# EasyEDA Pro project Mini inverter 12v to 220v.eprj

# Schematic Schematic1
Board Name: Board1; Create Date: 2026-03-27; Page Name: P1; Project Name: Mini inverter 12v to 220v; Schematic Name: Schematic1; Update Date: 2026-03-27; Company: EasyEDA.com; Page Size: A4; Version: V1.0
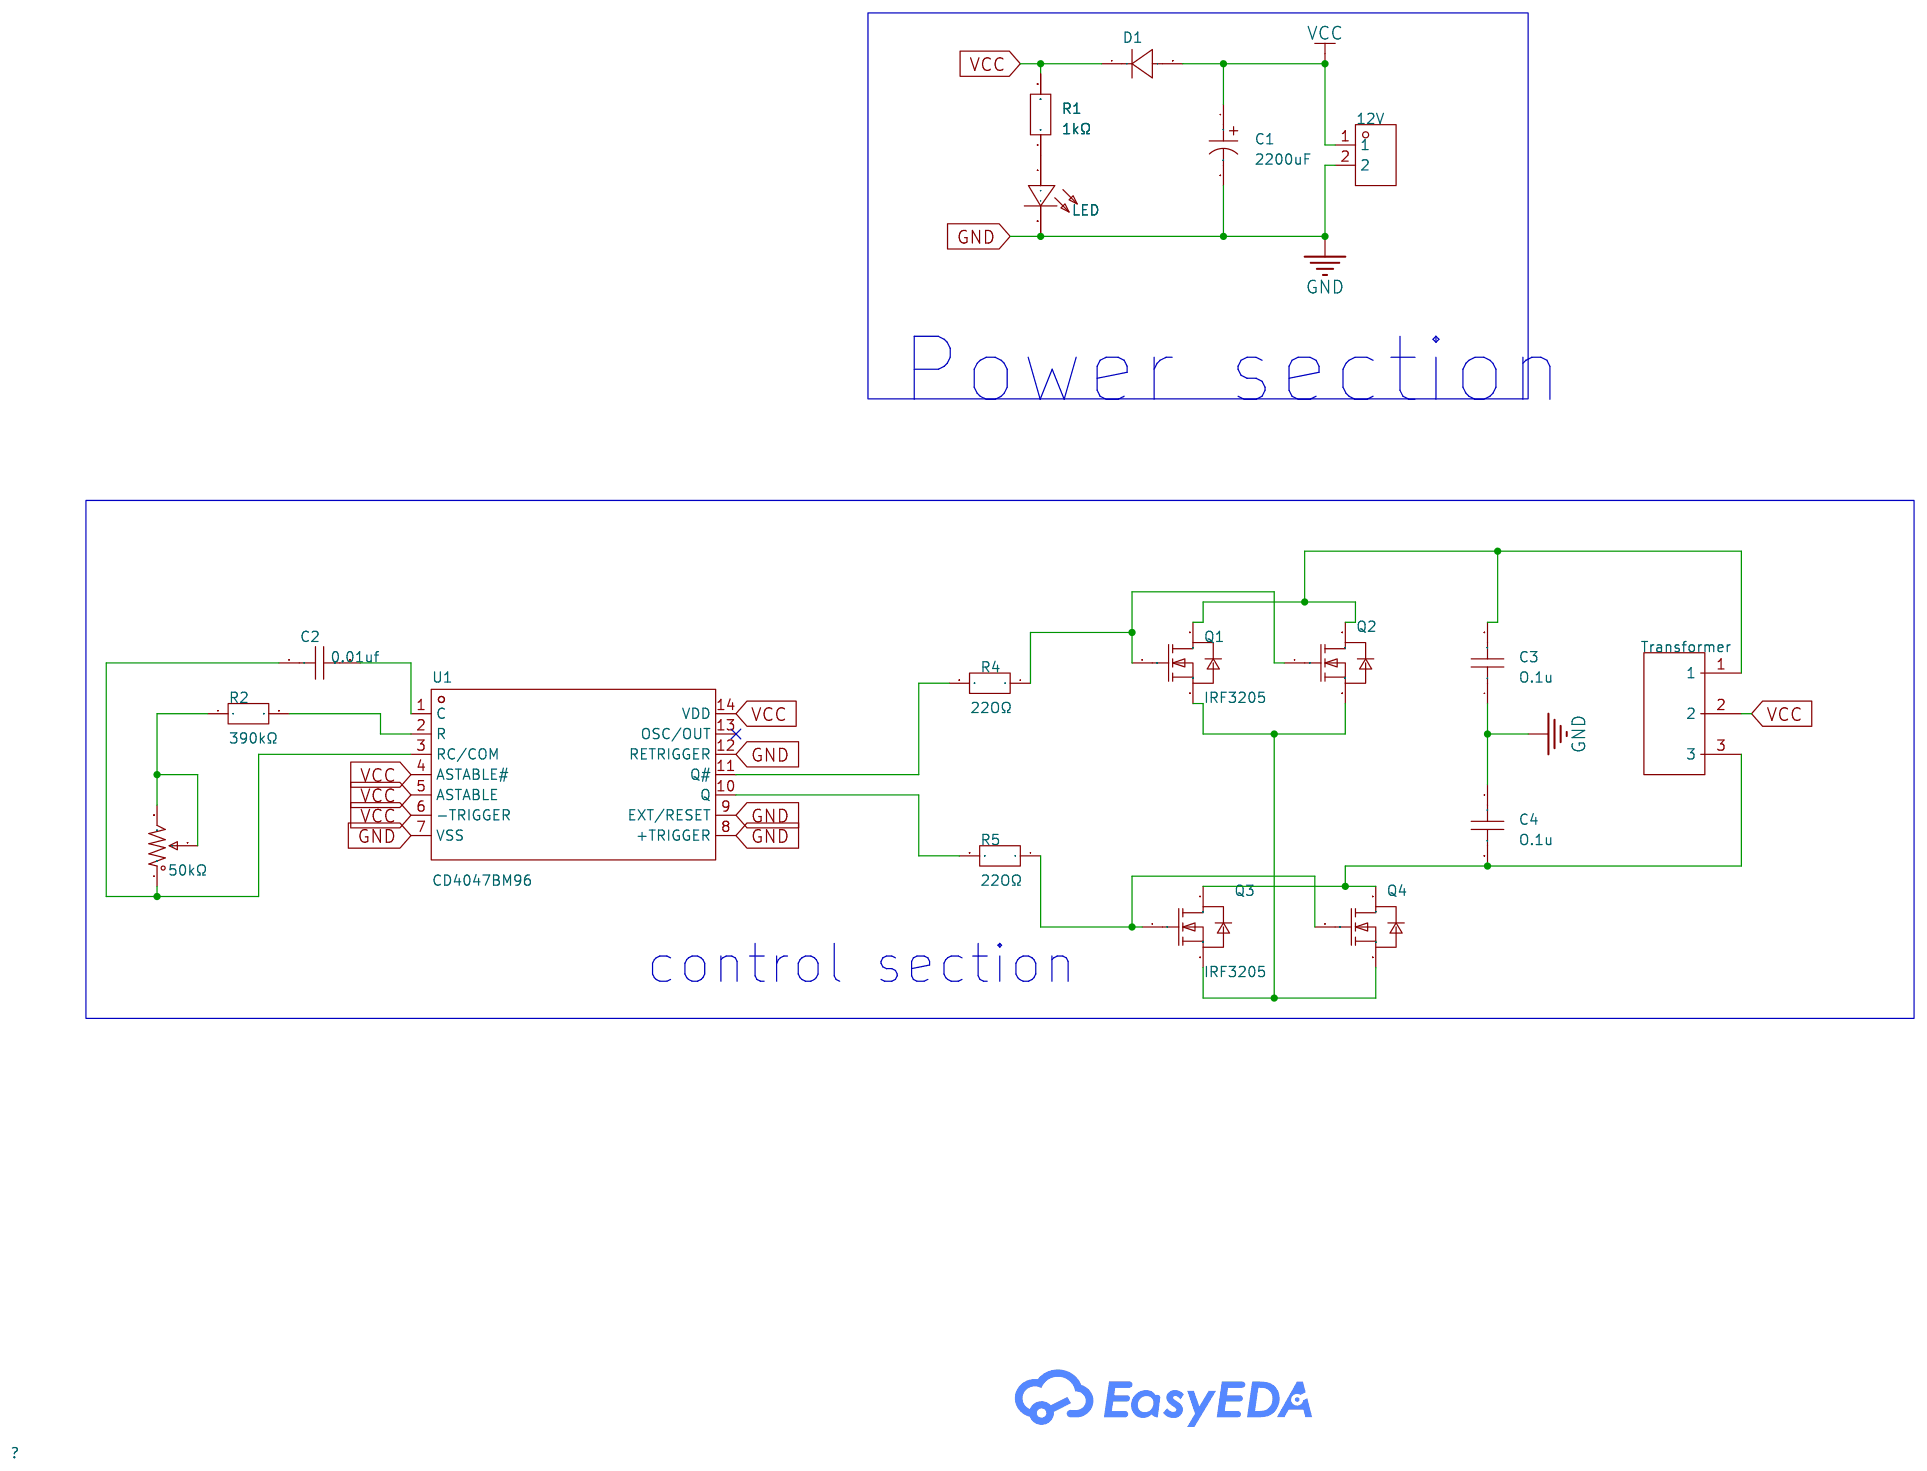
[diagram p0: schematic sheet]

## Parts
12V  WJ126V-5.0-2P-16-00A  [CONN-TH_WJ126V-5.0-2P]
C1  2200uF  [CAP-TH_BD13.0-P5.00-D0.6-FD]
C2  0.01uf  [C0603]
C3  O.1u  [C0603]
C4  O.1u  [C0603]
D1  -  [DO-41_BD2.4-L4.7-P8.70-D0.9-RD]
Q1  IRF3205  [TO-220-3_L10.0-W4.6-P2.54-L]
Q2  IRF3205  [TO-220-3_L10.0-W4.6-P2.54-L]
Q3  IRF3205  [TO-220-3_L10.0-W4.6-P2.54-L]
Q4  IRF3205  [TO-220-3_L10.0-W4.6-P2.54-L]
R1  1kΩ  [RES-TH_BD6.0-L17.5-P21.50-D0.8]
R2  390kΩ  [RES-TH_BD6.0-L17.5-P21.50-D0.8]
R3  50kΩ  [RES-ADJ-SMD_3P-L5.0-W4.5-P2.30-LS6.5_23BXX]
R4  22OΩ  [RES-TH_BD6.0-L17.5-P21.50-D0.8]
R5  22OΩ  [RES-TH_BD6.0-L17.5-P21.50-D0.8]
Transformer  WJ126V-5.0-03P-14-00A  [CONN-TH_3P-P5.00_WJ126V-5.0-3P]
U1  CD4047BM96  [SOP-14_L8.6-W3.9-P1.27-LS6.0-BL]
U2  LED  [LED-TH_BD4.0-P2.54-FD_RED]

## Library data of the parts
12V = WJ126V-5.0-2P-16-00A: LCSC Part Name: 红色 5mm 直插 排数:1 每排P数:2; Supplier Part: C3031437; Manufacturer: KANGNEX(康奈克斯电气); Supplier Footprint: 插件,P=5mm; JLCPCB Part Class: Extended Part; Datasheet: https://item.szlcsc.com/datasheet/WJ126V-5.0-2P-16-00A/3568895.html; Supplier: LCSC; Pitch: 5mm; Color: Red; Mounting Type: Through Hole; Number of Pins: 2P; Number of Rows: 1; Number of PINs Per Row: 2; Screw Specification: M2.5; Current Rating: 8A; Voltage Rating (Max): 300V; Wire Gauge - AWG: 14~26; Wire Gauge - mm2: 2.5; Operating Temperature: -40℃~+105℃
C1 = ERA25V2200M13X21: LCSC Part Name: 2200uF ±20% 25V; Supplier Part: C49256800; Manufacturer: JIERR(捷而瑞); Supplier Footprint: 插件,D13xL21mm; JLCPCB Part Class: Extended Part; Datasheet: https://item.szlcsc.com/datasheet/ERA25V2200M13X21/51692200.html; Supplier: LCSC; Tolerance: ±20%; Voltage Rating: 25V; Pin Spacing: 5mm; Diameter: 13mm; Height - Seated (Max): 21mm; Lifetime: 2000hrs@105℃; Operating Temperature: -40℃~+105℃
C2-C4 = FCC0603B103K500CT: LCSC Part Name: 10nF ±10% 50V; Supplier Part: C5137477; Manufacturer: FOJAN(富捷); Supplier Footprint: 0603; JLCPCB Part Class: Extended Part; Datasheet: https://item.szlcsc.com/datasheet/FCC0603B103K500CT/5746979.html; Supplier: LCSC; Tolerance: ±10%; Voltage Rating: 50V; Temperature Coefficient: X7R
D1 = 1N4007: Supplier Footprint: DO-41
Q1-Q4 = IRF3205: LCSC Part Name: 1个N沟道 耐压:55V 电流:110A; Supplier Part: C19189952; Manufacturer: minos(迈诺斯); Supplier Footprint: TO-220; JLCPCB Part Class: Extended Part; Datasheet: https://item.szlcsc.com/datasheet/IRF3205/20422303.html; Supplier: LCSC; Number: One N-channel; Drain to Source Voltage: 55V; Current - Continuous Drain(Id): 110A; RDS(on): 9mΩ@10V; Pd - Power Dissipation: 210W; Gate Threshold Voltage (Vgs(th)): 4V@250uA; Gate Charge(Qg): 146nC@10V; Input Capacitance(Ciss): 3.247nF@25V; Reverse Transfer Capacitance (Crss@Vds): 211pF@25V; Operating Temperature: -55℃~+175℃; Type: N-Channel
R1 R2 R4 R5 = RSMF5JB1K00: LCSC Part Name: 金属氧化膜电阻 1kΩ ±5% 5W; Supplier Part: C2646141; Manufacturer: SEI(Stackpole Electronics Inc.); Supplier Footprint: 插件,D6xL17.5mm; JLCPCB Part Class: Extended Part; Datasheet: https://atta.szlcsc.com/upload/public/pdf/source/20210417/E7D670218B9E9D0CE2FA9103C376073D.pdf; Supplier: LCSC; Type: Metal Oxide Resistors; Tolerance: ±5%; Power(Watts): 5W; Temperature Coefficient: ±200ppm/℃; Operating Temperature: -55℃~+235℃
R3 = 23BR50KLFTR: LCSC Part Name: 50kΩ ±20%; Supplier Part: C5883569; Manufacturer: TT Electronics; JLCPCB Part Class: Extended Part; Datasheet: https://item.szlcsc.com/datasheet/23BR50KLFTR/6817880.html; Supplier: LCSC; Tolerance: ±20%; Power(Watts): 250mW; Temperature Coefficient: ±100ppm/℃
Transformer = WJ126V-5.0-03P-14-00A: LCSC Part Name: 1x3P 5mm 直插 排数:1 每排P数:3; Supplier Part: C8401; Manufacturer: KANGNEX(康奈克斯电气); Supplier Footprint: 插件,P=5mm; JLCPCB Part Class: Extended Part; Datasheet: https://item.szlcsc.com/datasheet/WJ126V-5.0-03P-14-00A/8895.html; Supplier: LCSC; Number of Positions or Pins: 1x3P; Pitch: 5mm; Color: Green; Mounting Type: Through Hole; Number of Pins: 3P; Number of Rows: 1; Number of PINs Per Row: 3; Current Rating: 18A; Voltage Rating (Max): 250V; Wire Gauge - AWG: 14~26; Wire Gauge - mm2: 2.5; Operating Temperature: -40℃~+105℃
U1 = CD4047BM96: Supplier Part: C46538; Manufacturer: TI(德州仪器); Supplier Footprint: SOP-14; JLCPCB Part Class: Extended Part; Datasheet: https://www.ti.com/cn/lit/gpn/cd4047b; Supplier: LCSC; Logic Type: Monostable；Astable; Voltage - Supply: 3V~18V; Number Of Channels: 1; Propagation Delay Time: 80ns; Current - Output Low(IOL): 6.8mA; Current - Output High(IOH): 6.8mA; Logic Family: 4000B; Operating Temperature: -55℃~+125℃
U2 = LED: Supplier Part: C9900015665; Supplier Footprint: SIP-2P; JLCPCB Part Class: Extended Part; Supplier: LCSC

## Nets
GND: 12V.2 C1.2 C3.1 C4.1 U1.7(VSS) U1.8(+TRIGGER) U1.9(EXT/RESET) U1.12(RETRIGGER) U2.2(-)
VCC: 12V.1 C1.1 D1.1(K) D1.2(A) R1.2 Transformer.2 U1.4(ASTABLE#) U1.5(ASTABLE) U1.6(-TRIGGER) U1.14(VDD)
$1N994: R1.1 U2.1(+)
$1N1364: C2.2 U1.1(C)
$1N1389: R2.2 U1.2(R)
$1N1395: R2.1 R3.2 R3.3
$1N1413: C2.1 R3.1 U1.3(RC/COM)
$1N1527: R4.2 U1.11(Q#)
$1N1541: R5.2 U1.10(Q)
$1N1850: Q1.1(G) Q2.1(G) R4.1
$1N2039: Q3.1(G) Q4.1(G) R5.1
$1N2051: Q1.3(S) Q2.3(S) Q3.3(S) Q4.3(S)
$1N2312: C3.2 Q1.2(D) Q2.2(D) Transformer.1
$1N2320: C4.2 Q3.2(D) Q4.2(D) Transformer.3

Not connected (* = marked no-connect by the designer): U1 13(OSC/OUT)*

## Notes on the sheet
- Power section
- control section

# Board PCB1
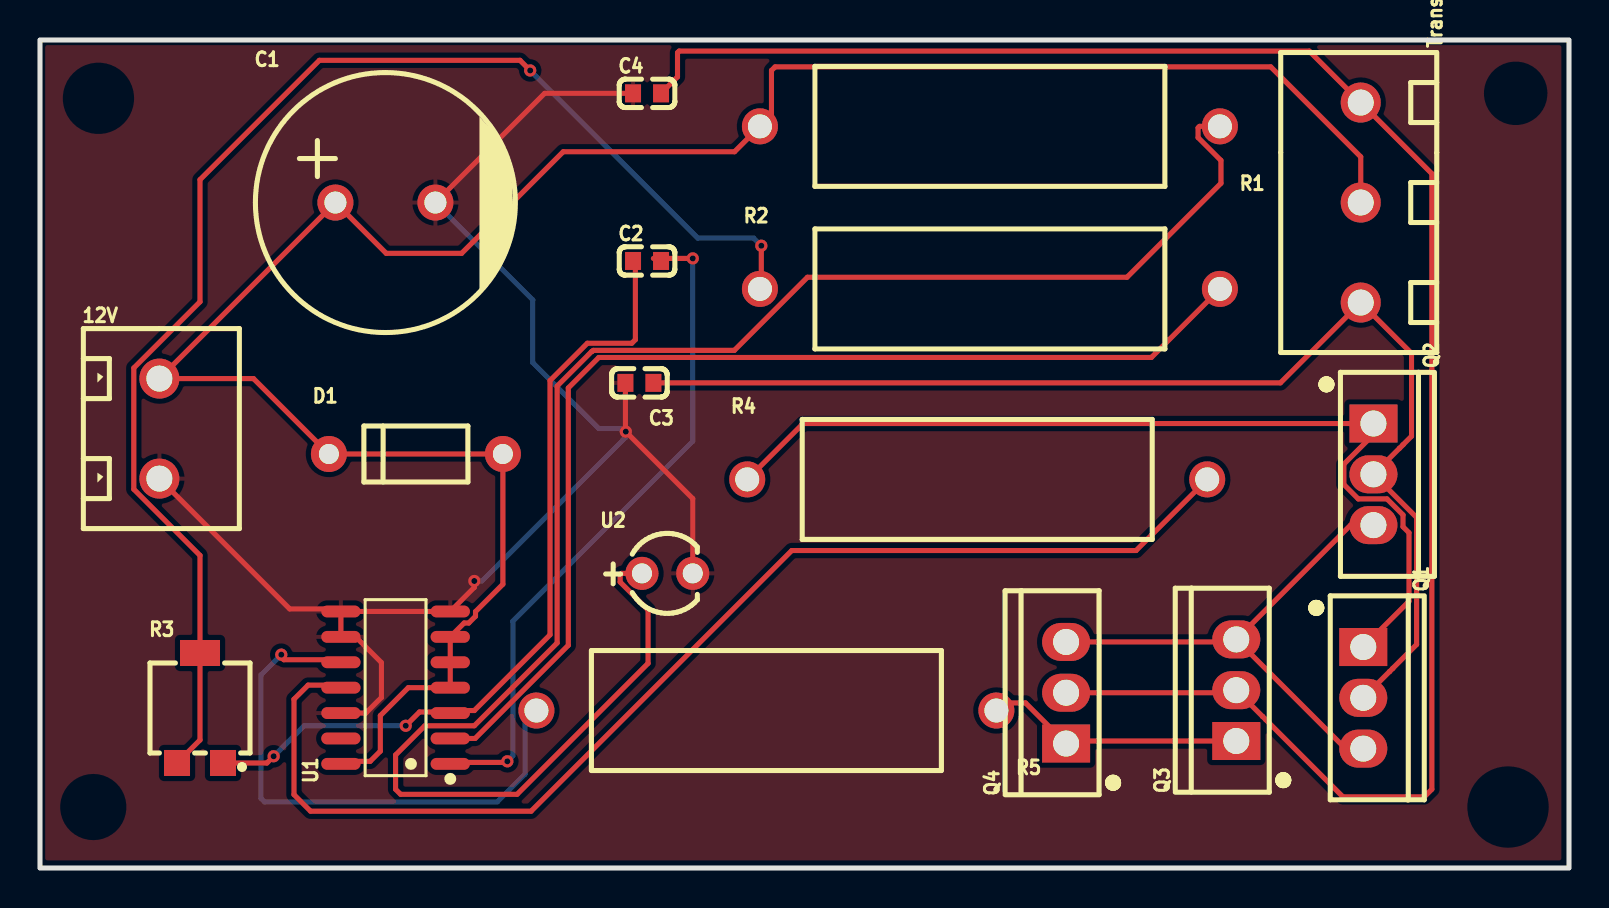
[diagram p1: board, top side]
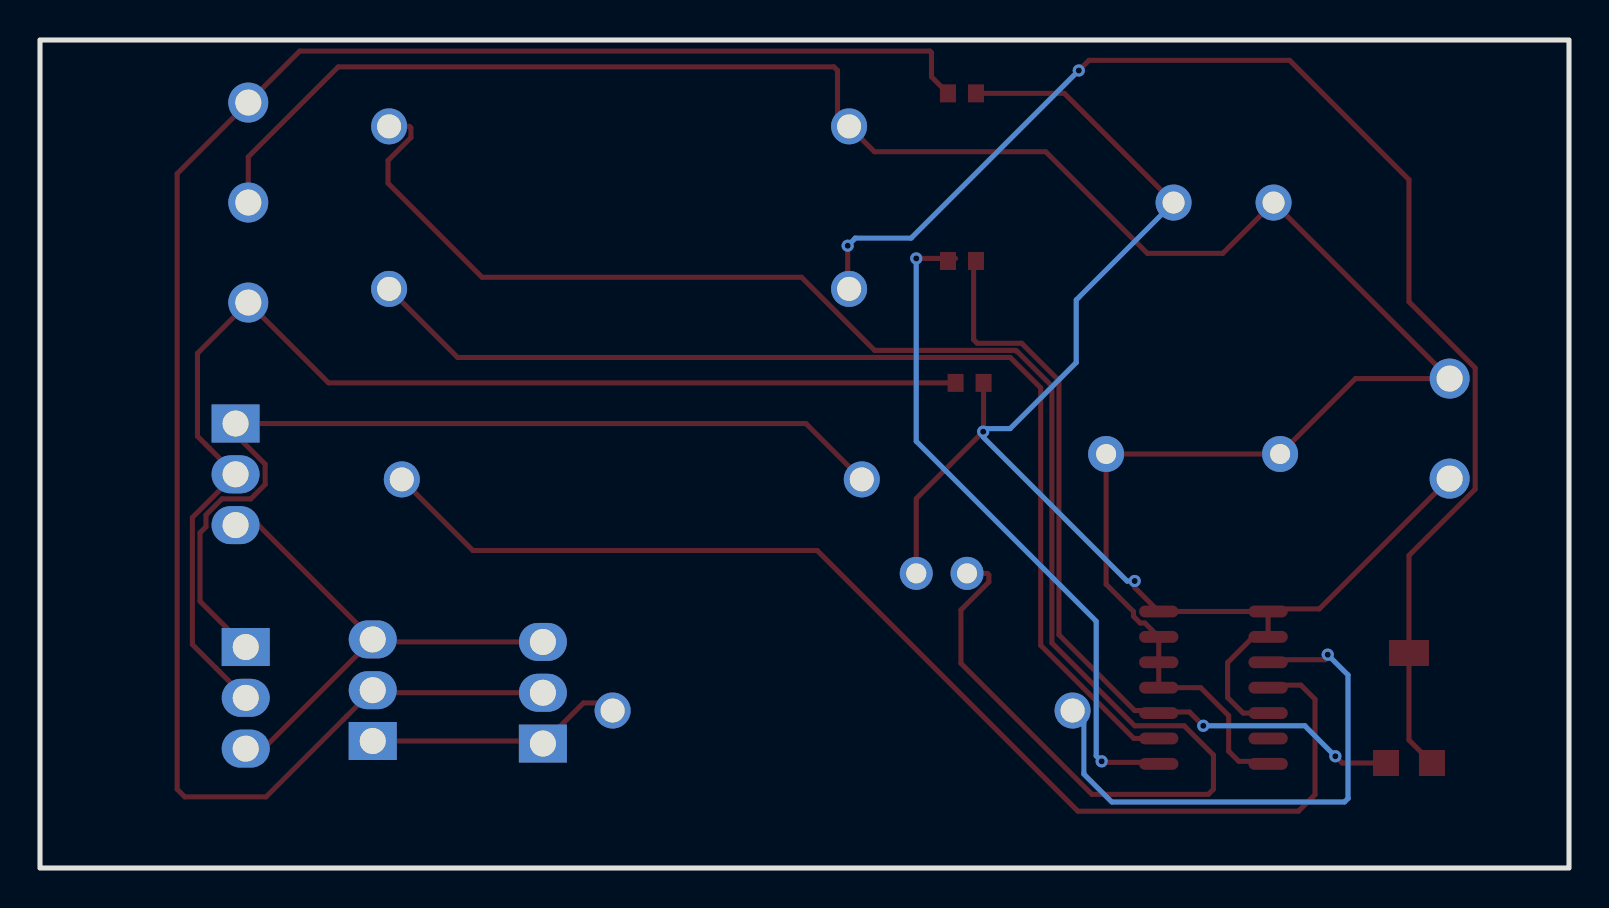
[diagram p2: board, bottom side, seen from below]

Outline 76.45 x 41.4 mm; copper layers: Top Layer, Bottom Layer. Coordinates in mm from the lower left corner of the outline.
Outline path: rectangle 0,41.4 76.45,0
Stack: Top Layer 0.035mm / Dielectric1 1.51mm FR4 er 4.5 / Bottom Layer 0.035mm

## Design rules (mm)
template: JLCPCB Capability(Two Layers Board)
spacing copperThickness1oz (default): track to track 0.102, other pairs 0.152 to 0.3
spacing copperThickness2oz: track to track 0.203, other pairs 0.152 to 0.3
track width copperThickness1oz (default): min 0.127, default 0.254, max 2.54
track width copperThickness2oz: min 0.203, default 0.254, max 2.54
differential pair differentialPair (default): width min 0.127, default 0.254, max 2.54; gap min 0.152, default 0.152
via viaSize (default): diameter min 0.5, default 0.61, max 10; hole min 0.3, default 0.305, max 6.3

## Placement (name value [footprint] x y rotation side)
12V  WJ126V-5.0-2P-16-00A  [CONN-TH_WJ126V-5.0-2P]  5.97 21.97 0 top
C1  2200uF  [CAP-TH_BD13.0-P5.00-D0.6-FD]  17.27 33.27 0 top
C2  0.01uf  [C0603]  30.35 30.35 0 top
C3  O.1u  [C0603]  29.97 24.26 0 top
C4  O.1u  [C0603]  30.35 38.73 0 top
D1  -  [DO-41_BD2.4-L4.7-P8.70-D0.9-RD]  18.8 20.7 0 top
Q1  IRF3205  [TO-220-3_L10.0-W4.6-P2.54-L]  66.17 8.51 270 top
Q2  IRF3205  [TO-220-3_L10.0-W4.6-P2.54-L]  66.67 19.68 270 top
Q3  IRF3205  [TO-220-3_L10.0-W4.6-P2.54-L]  59.82 8.89 90 top
Q4  IRF3205  [TO-220-3_L10.0-W4.6-P2.54-L]  51.31 8.76 90 top
R1  1kΩ  [RES-TH_BD6.0-L17.5-P21.50-D0.8]  47.5 37.08 180 top
R2  390kΩ  [RES-TH_BD6.0-L17.5-P21.50-D0.8]  47.5 28.96 0 top
R3  50kΩ  [RES-ADJ-SMD_3P-L5.0-W4.5-P2.30-LS6.5_23BXX]  8 8 0 top
R4  22OΩ  [RES-TH_BD6.0-L17.5-P21.50-D0.8]  46.86 19.43 0 top
R5  22OΩ  [RES-TH_BD6.0-L17.5-P21.50-D0.8]  36.32 7.87 180 top
Transformer  WJ126V-5.0-03P-14-00A  [CONN-TH_3P-P5.00_WJ126V-5.0-3P]  66.04 33.27 270 top
U1  CD4047BM96  [SOP-14_L8.6-W3.9-P1.27-LS6.0-BL]  17.78 9.02 90 top
U2  LED  [LED-TH_BD4.0-P2.54-FD_RED]  31.37 14.73 0 top

## Footprints (pads in the part's own frame, mm; a bottom-side part is the same pattern mirrored in y, then rotated)
C0603
  rect 0.8x0.9 smd: 1(-0.7,0) 2(0.7,0)
CAP-TH_BD13.0-P5.00-D0.6-FD
  round 1.8 hole 1.1: 1(-2.5,0) 2(2.5,0)
CONN-TH_3P-P5.00_WJ126V-5.0-3P
  round 2 hole 1.3: 1(5,0) 2(-0.002,0) 3(-5,0)
CONN-TH_WJ126V-5.0-2P
  round 2 hole 1.3: 1(0,2.501) 2(0,-2.501)
DO-41_BD2.4-L4.7-P8.70-D0.9-RD
  round 1.8 hole 1: 1(-4.35,0) 2(4.35,0)
LED-TH_BD4.0-P2.54-FD_RED
  round 1.651 hole 1: 1(-1.27,0) 2(1.27,0)
RES-ADJ-SMD_3P-L5.0-W4.5-P2.30-LS6.5_23BXX
  rect 1.3x1.3 smd: 1(1.15,-2.75) 3(-1.15,-2.75)
  rect 2x1.3 smd: 2(0,2.75)
RES-TH_BD6.0-L17.5-P21.50-D0.8
  round 1.8 hole 1.2: 1(-11.5,0) 2(11.5,0)
SOP-14_L8.6-W3.9-P1.27-LS6.0-BL
  oval 0.595x1.968 smd: 1(-3.81,-2.734) 2(-2.54,-2.734) 3(-1.27,-2.734) 4(0,-2.734) 5(1.27,-2.734) 6(2.54,-2.734) 7(3.81,-2.734) 8(3.81,2.734) 9(2.54,2.734) 10(1.27,2.734) 11(0,2.734) 12(-1.27,2.734) 13(-2.54,2.734) 14(-3.81,2.734)
TO-220-3_L10.0-W4.6-P2.54-L
  rect 1.9x2.4 hole 1.3: 1(-2.54,0)
  oval 1.9x2.4 hole 1.3: 2(0,0) 3(2.54,0)

## Nets
As in the schematic.

Pads without a net: U1 13

## Via types
v1: diameter 0.61, hole 0.305, Top Layer to Bottom Layer, 9 vias

## Routing (per net, layer and track width the routed paths; a pad name or vN(x,y) marks a point on that pad's centre or on a via; arc(x,y) is an arc through that point)
GND: length 76.7
  Top Layer w0.254: 14.66,12.95 12.49,12.95 12V.2 ; 29.27,24.26 29.27,21.84 v1(29.29,21.82) 32.64,18.47 U2.2 ; U1.12 16.29,7.75 17.07,8.52 17.07,10.27 15.79,11.56 U1.9 U1.8 U1.7 21.72,14.03 v1(21.72,14.35) ; C4.1 25.23,38.73 C1.2
  Bottom Layer w0.254: v1(21.72,14.35) 22.1,14.35 29.29,21.55 v1(29.29,21.82) ; 29.21,21.97 27.94,21.97 24.64,25.27 24.64,28.41 C1.2
VCC: length 113.8
  Top Layer w0.254: 14.79,5.33 16.51,5.33 17.02,5.84 17.02,7.62 18.41,9.02 20.13,9.02 20.26,9.14 ; Transformer.2 66.04,35.56 61.54,40.06 36.76,40.06 36.58,39.88 36.58,37.66 R1.2 34.73,35.81 26.16,35.81 21.08,30.73 17.31,30.73 C1.1 12V.1 10.68,24.47 D1.1 D1.2 23.15,14.19 21.78,12.82 21.78,12.59 21.44,12.25 21.21,12.25 U1.6 U1.5 U1.4
$1N994: length 88.3
  Top Layer w0.254: U2.1 29.08,14.73 29.01,14.66 29.01,14.3 30.41,12.9 30.41,10.23 23.85,3.68 18.03,3.68 17.78,3.94 17.78,5.65 19.24,7.11 21.72,7.11 25.86,11.25 25.86,24.1 27.59,25.83 27.61,25.83 27.67,25.88 34.72,25.88 38.37,29.54 54.35,29.54 59.05,34.24 59.05,35.38 57.91,36.52 57.91,37.01 57.98,37.08 R1.1
$1N1364: length 34.1
  Top Layer w0.254: 30.67,30.48 v1(32.64,30.48) ; 20.26,5.33 20.31,5.28 23.31,5.28 v1(23.37,5.33)
  Bottom Layer w0.254: v1(32.64,30.48) 32.64,21.34 23.64,12.34 23.64,5.61 v1(23.37,5.33)
$1N1389: length 55.8
  Top Layer w0.254: 20.13,6.6 20.26,6.48 21.76,6.48 26.42,11.14 26.42,24 27.94,25.53 55.57,25.53 R2.2
$1N1395: length 68.8
  Top Layer w0.254: v1(36.07,31.11) 36.07,29.03 R2.1 ; 24.38,40 24,40.39 13.97,40.39 8,34.42 8,28.31 4.69,25 4.69,18.94 8,15.63 R3.2 8,6.4 R3.3
  Bottom Layer w0.254: v1(36.07,31.11) 35.69,31.5 32.89,31.5 v1(24.51,39.88)
$1N1413: length 40.9
  Top Layer w0.254: R3.1 11.35,5.25 v1(11.68,5.59) ; C2.1 29.77,30.24 29.77,26.42 29.59,26.24 27.37,26.24 25.5,24.37 25.5,11.66 21.72,7.87 20.64,7.87 U1.3 20.51,7.8 18.98,7.8 v1(18.29,7.11)
  Bottom Layer w0.254: v1(18.29,7.11) 13.21,7.11 v1(11.68,5.59)
$1N1527: length 60
  Top Layer w0.254: 14.79,9.14 13.41,9.14 12.7,8.44 12.7,3.67 13.53,2.84 24.56,2.84 37.59,15.88 54.81,15.88 R4.2
$1N1541: length 27.7
  Top Layer w0.254: 12.06,10.54 12.19,10.41 14.79,10.41
  Bottom Layer w0.254: R5.2 24.26,7.31 24.26,4.7 22.86,3.3 11.23,3.3 11.05,3.48 11.05,9.65 v1(12.06,10.67)
$1N1850: length 47.4
  Top Layer w0.254: Q1.1 68.45,13.33 68.45,16.76 68.15,17.06 68.15,17.65 67.35,18.46 65.92,18.46 65.2,19.18 65.2,20.19 66.67,21.67 Q2.1 38.16,22.22 R4.1
$1N2039: length 12.9
  Top Layer w0.254: Q3.1 51.44,6.35 Q4.1 49.28,8.25 47.82,8.25
$1N2051: length 26.4
  Top Layer w0.254: 59.82,11.43 65.28,5.97 Q1.3 ; 59.82,11.43 59.69,11.3 Q4.3 ; 59.82,11.43 65.53,17.14 Q2.3
$1N2312: length 60.6
  Top Layer w0.254: C3.2 62.02,24.26 Transformer.1 68.58,25.73 68.58,21.59 68.15,21.16 68.15,21.16 67.99,21 67.99,21 Q2.2 68.83,17.53 68.83,11.18 67.65,9.99 67.65,9.98 67.48,9.82 67.48,9.82 Q1.2
$1N2320: length 94.2
  Top Layer w0.254: C4.2 31.88,39.56 31.88,40.77 31.96,40.85 63.47,40.85 Transformer.3 69.6,34.72 69.6,3.94 69.22,3.56 65.15,3.56 61.3,7.41 61.3,7.42 61.13,7.58 61.13,7.58 Q3.2 59.69,8.76 Q4.2

## Copper pours and planes (outline as drawn; the poured copper is in the pictures)
GND on Top Layer: 0.25,41.15 76.07,41.15 76.07,0.38 0.25,0.38
(no net) on Bottom Layer: 0,41.4 76.45,41.4 76.45,0 0,0
